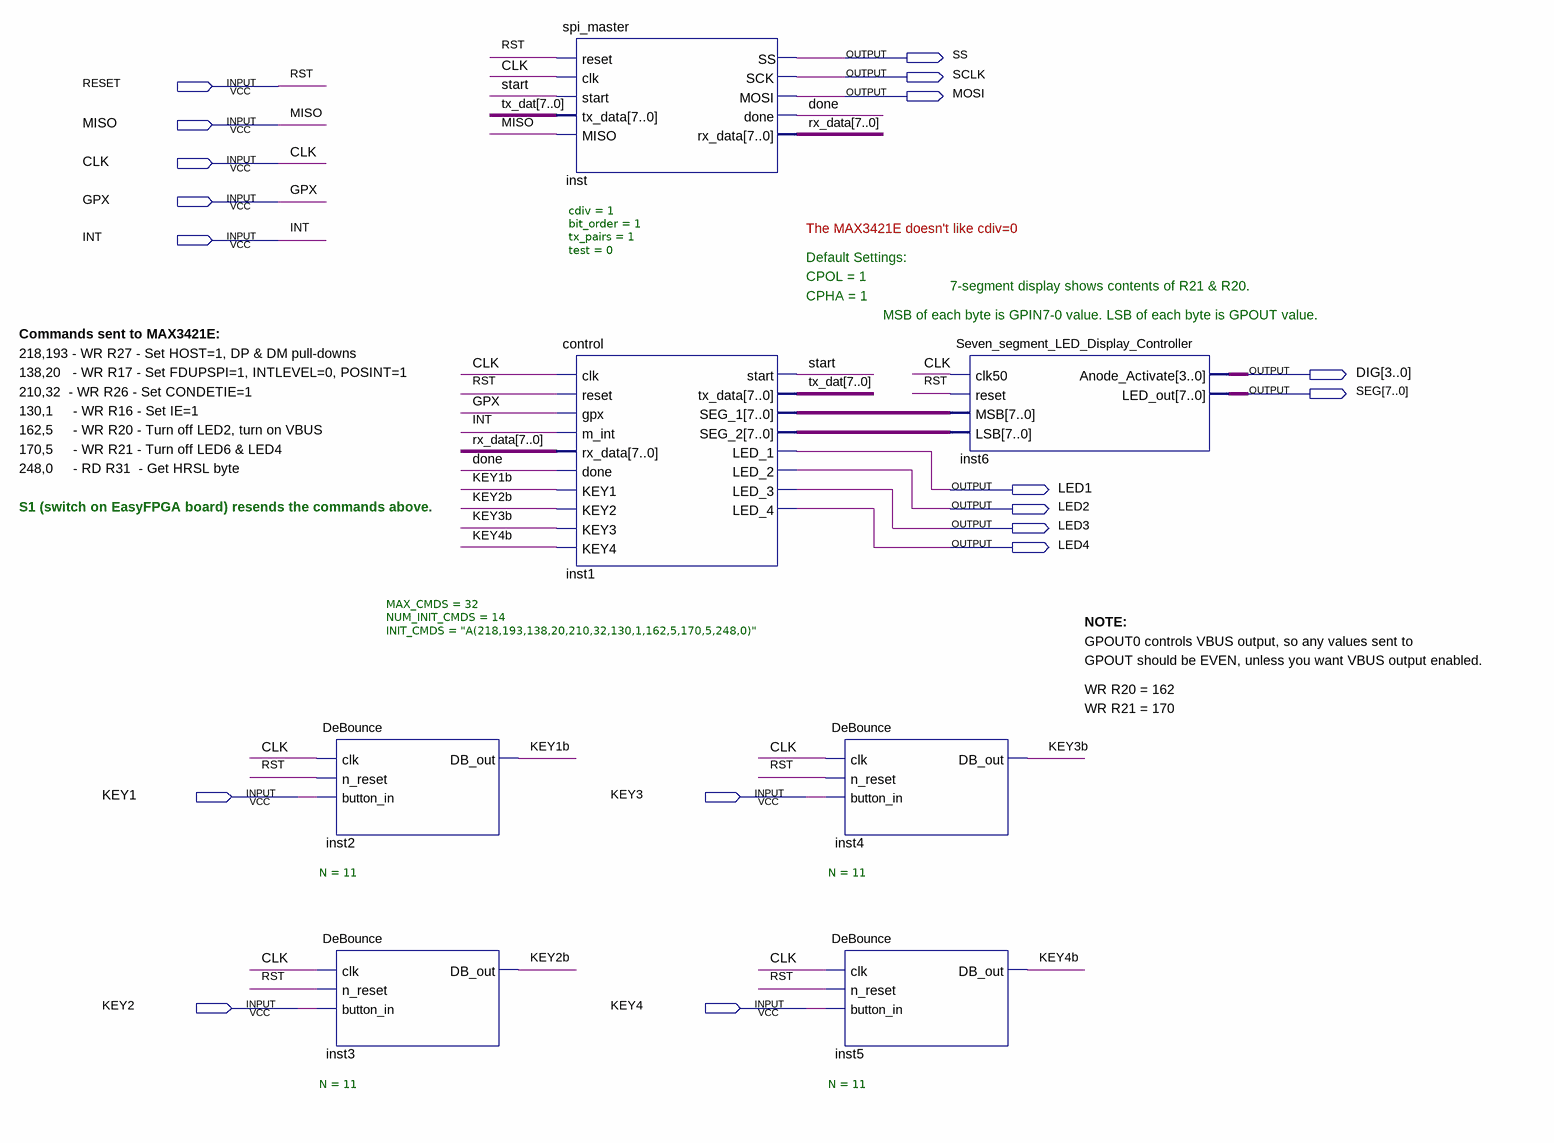
[diagram p0: schematic sheet]
// Quartus schematic USB_Test.bdf as structural Verilog: 7 symbols, 18 pins
module USB_Test (
  input  RESET,
  input  MISO,
  input  CLK,
  input  GPX,
  input  INT,
  input  KEY1,
  input  KEY3,
  input  KEY2,
  input  KEY4,
  output SS,
  output SCLK,
  output MOSI,
  output [3:0] DIG,
  output [7:0] SEG,
  output LED1,
  output LED2,
  output LED3,
  output LED4
);

  wire done, KEY1b, KEY2b, KEY3b, KEY4b, start;
  wire [7:0] inst1_seg_1, inst1_seg_2, rx_data, tx_dat;

  DeBounce #(.N(11)) inst2 (.clk(CLK), .n_reset(RESET), .button_in(KEY1), .DB_out(KEY1b));
  DeBounce #(.N(11)) inst3 (.clk(CLK), .n_reset(RESET), .button_in(KEY2), .DB_out(KEY2b));
  spi_master #(.cdiv(1), .bit_order(1), .tx_pairs(1), .test(0)) inst (
    .reset(RESET), .clk(CLK), .start(start), .tx_data(tx_dat), .MISO(MISO), .SS(SS), .SCK(SCLK), .MOSI(MOSI),
    .done(done), .rx_data(rx_data));
  control #(.MAX_CMDS(32), .NUM_INIT_CMDS(14), .INIT_CMDS("A(218,193,138,20,210,32,130,1,162,5,170,5,248,0)")) inst1 (
    .clk(CLK), .reset(RESET), .gpx(GPX), .m_int(INT), .rx_data(rx_data), .done(done), .KEY1(KEY1b),
    .KEY2(KEY2b), .KEY3(KEY3b), .KEY4(KEY4b), .start(start), .tx_data(tx_dat), .SEG_1(inst1_seg_1),
    .SEG_2(inst1_seg_2), .LED_1(LED1), .LED_2(LED2), .LED_3(LED3), .LED_4(LED4));
  DeBounce #(.N(11)) inst4 (.clk(CLK), .n_reset(RESET), .button_in(KEY3), .DB_out(KEY3b));
  DeBounce #(.N(11)) inst5 (.clk(CLK), .n_reset(RESET), .button_in(KEY4), .DB_out(KEY4b));
  Seven_segment_LED_Display_Controller inst6 (
    .clk50(CLK), .reset(RESET), .MSB(inst1_seg_1), .LSB(inst1_seg_2), .Anode_Activate(DIG), .LED_out(SEG));

  // Other names for the same wires on the sheet: RST = RESET

  // Notes on the sheet:
  //   The MAX3421E doesn't like cdiv=0
  //   Default Settings:
  //   CPOL = 1
  //   7-segment display shows contents of R21 & R20.
  //   CPHA = 1
  //   MSB of each byte is GPIN7-0 value. LSB of each byte is GPOUT value.
  //   Commands sent to MAX3421E:
  //   218,193 - WR R27 - Set HOST=1, DP & DM pull-downs
  //   138,20   - WR R17 - Set FDUPSPI=1, INTLEVEL=0, POSINT=1
  //   210,32  - WR R26 - Set CONDETIE=1
  //   130,1     - WR R16 - Set IE=1
  //   162,5     - WR R20 - Turn off LED2, turn on VBUS
  //   170,5     - WR R21 - Turn off LED6 & LED4
  //   248,0     - RD R31  - Get HRSL byte
  //   S1 (switch on EasyFPGA board) resends the commands above.
  //   NOTE:
  //   GPOUT0 controls VBUS output, so any values sent to
  //   GPOUT should be EVEN, unless you want VBUS output enabled.
  //   WR R20 = 162
  //   WR R21 = 170
endmodule
